# EAGLE design neuron (EAGLE 9.3.2)
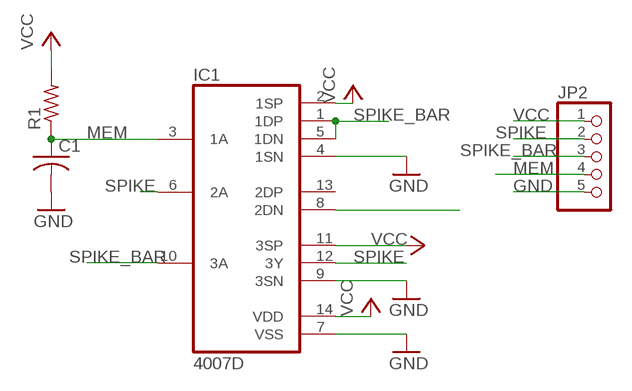
[diagram p0: schematic, sheet 1]

## Parts
C1  C-USC0805  [C0805]
IC1  4007D  [SO14]
JP2  PINHD-1X5  [1X05]
R1  R-US_R0805  [R0805]

## Nets
GND: C1.2 IC1.4(1SN) IC1.7(VSS) IC1.9(3SN) JP2.5
MEM: C1.1 IC1.3(1A) IC1.8(2DN) JP2.4 R1.1
SPIKE: IC1.6(2A) IC1.12(3Y) JP2.2
SPIKE_BAR: IC1.1(1DP) IC1.5(1DN) IC1.10(3A) JP2.3
VCC: IC1.2(1SP) IC1.11(3SP) IC1.14(VDD) JP2.1 R1.2
Unconnected: IC1.13(2DP)

## Library data of the parts
C1 = rcl:C-US: CAPACITOR, American symbol
IC1 = 40xx:4007: Dual COMPLIMENTARY PAIR plus INVERTER
JP2 = pinhead:PINHD-1X5: PIN HEADER
R1 = rcl:R-US_: RESISTOR, American symbol

## Board
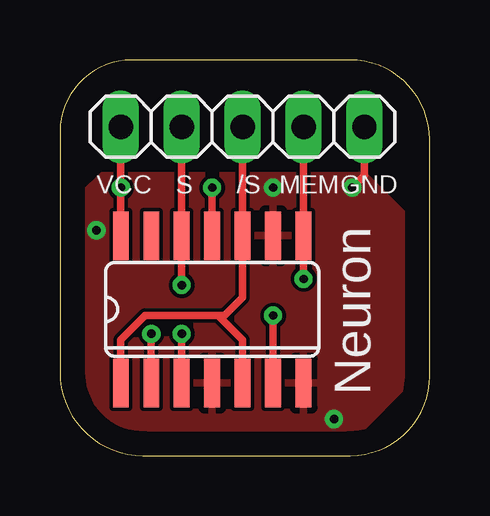
[diagram p1: board, top side]
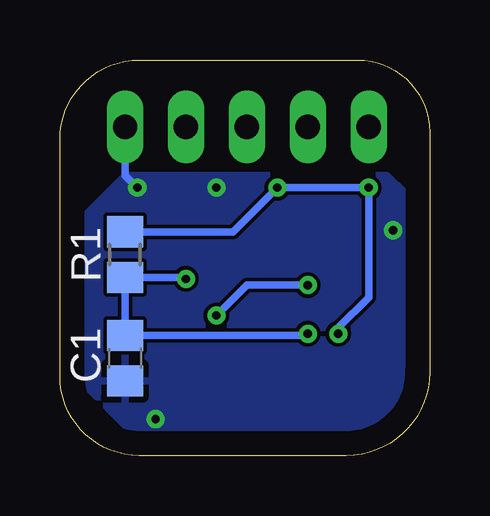
[diagram p2: board, bottom side, seen from below]

Size 15.42 x 16.5 mm. Coordinates in mm from the lower left corner, seen from the top.
Outline: 12.1,16.5 3,16.5 arc90 0,13.5 0,3.47 arc90 3.47,0 12.11,0 arc90 15.42,3.31 15.42,13.18 arc90 12.1,16.5
Copper layers (1*16): Top 0.035mm / dielectric 1.5mm / Bottom 0.035mm
Design rules "default": minimum track width 6mil, minimum drill 0.35mm, track to track 6mil, track to pad 6mil, pad to pad 6mil, via to via 6mil, smd to smd 6mil, copper to edge 40mil, drill to drill 6mil, minimum pad ring 10mil, minimum via ring 8mil, stop-mask expansion 4mil, vias tented up to drill 0mil, thermal gap 10mil

### Footprints (pad centres in the part's own frame; a part is rotated, then mirrored left to right if it is on the bottom)
C0805 = smd 1.3 x 1.5: 1 -0.95,0; 2 0.95,0
SO14 = smd 0.66 x 2.032: 1 -3.81,-3.073; 2 -2.54,-3.073; 3 -1.27,-3.073; 4 0,-3.073; 5 1.27,-3.073; 6 2.54,-3.073; 7 3.81,-3.073; 8 3.81,3.073; 9 2.54,3.073; 10 1.27,3.073; 11 0,3.073; 12 -1.27,3.073; 13 -2.54,3.073; 14 -3.81,3.073
1X05 = drill 1.016 long: 1 -5.08,0; 2 -2.54,0; 3 0,0; 4 2.54,0; 5 5.08,0
R0805 = smd 1.3 x 1.5: 1 -0.95,0; 2 0.95,0

### Placement (x,y rotation side)
C1  12.7,4.06 270 bottom
IC1  6.35,6.1 0 top
JP2  7.62,13.72 0 top
R1  12.7,8.38 90 bottom

### Tracks (layer width: path | path; a pad name or v marks a point on that pad's centre or on a via)
GND  (via drill 0.35)
  Top 0.305: JP2.5 12.7,11.68 v12.19,11.18
  Bottom 0.305: JP2.5 12.7,11.68 v12.19,11.18
  other vias: 1.52,9.4 11.43,1.52 8.89,11.18
  pour Top: 1.78,11.68 12.7,11.68 14.48,9.91 14.48,3.05 12.45,1.02 2.29,1.02 1.02,2.29 1.02,10.92
  pour Bottom: 1.78,11.68 12.7,11.68 14.48,9.91 14.48,3.05 12.45,1.02 2.29,1.02 1.02,2.29 1.02,10.92
MEM  (via drill 0.35)
  Top 0.305: v5.08,5.08 IC1.3 | v10.16,7.37 IC1.8 JP2.4
  Bottom 0.305: v5.08,5.08 5.15,5.01 C1.1 R1.1 10.23,7.43 v10.16,7.37
SPIKE  (via drill 0.35)
  Top 0.305: IC1.6 v8.89,5.84 | v5.08,7.11 IC1.12 JP2.2
  Bottom 0.305: v8.89,5.84 7.62,7.11 v5.08,7.11
SPIKE_BAR
  Top 0.305: IC1.1 2.54,4.83 3.56,5.84 6.6,5.84 | 6.6,5.84 7.62,4.83 IC1.5 | 6.6,5.84 6.86,5.84 7.62,6.6 IC1.10 JP2.3
VCC  (via drill 0.35)
  Top 0.305: IC1.14 v2.54,11.18 JP2.1 | v6.35,11.18 IC1.11 | v3.81,5.08 IC1.2
  Bottom 0.305: R1.2 10.41,9.33 8.19,9.33 v6.35,11.18 v2.54,11.18 2.54,6.6 3.81,5.33 v3.81,5.08

### Text on the board
tNames: VCC | S | /S | MEM | GND | Neuron